# Altium schematic sheet Yusynth VCA - Schematic.SchDoc
size Letter
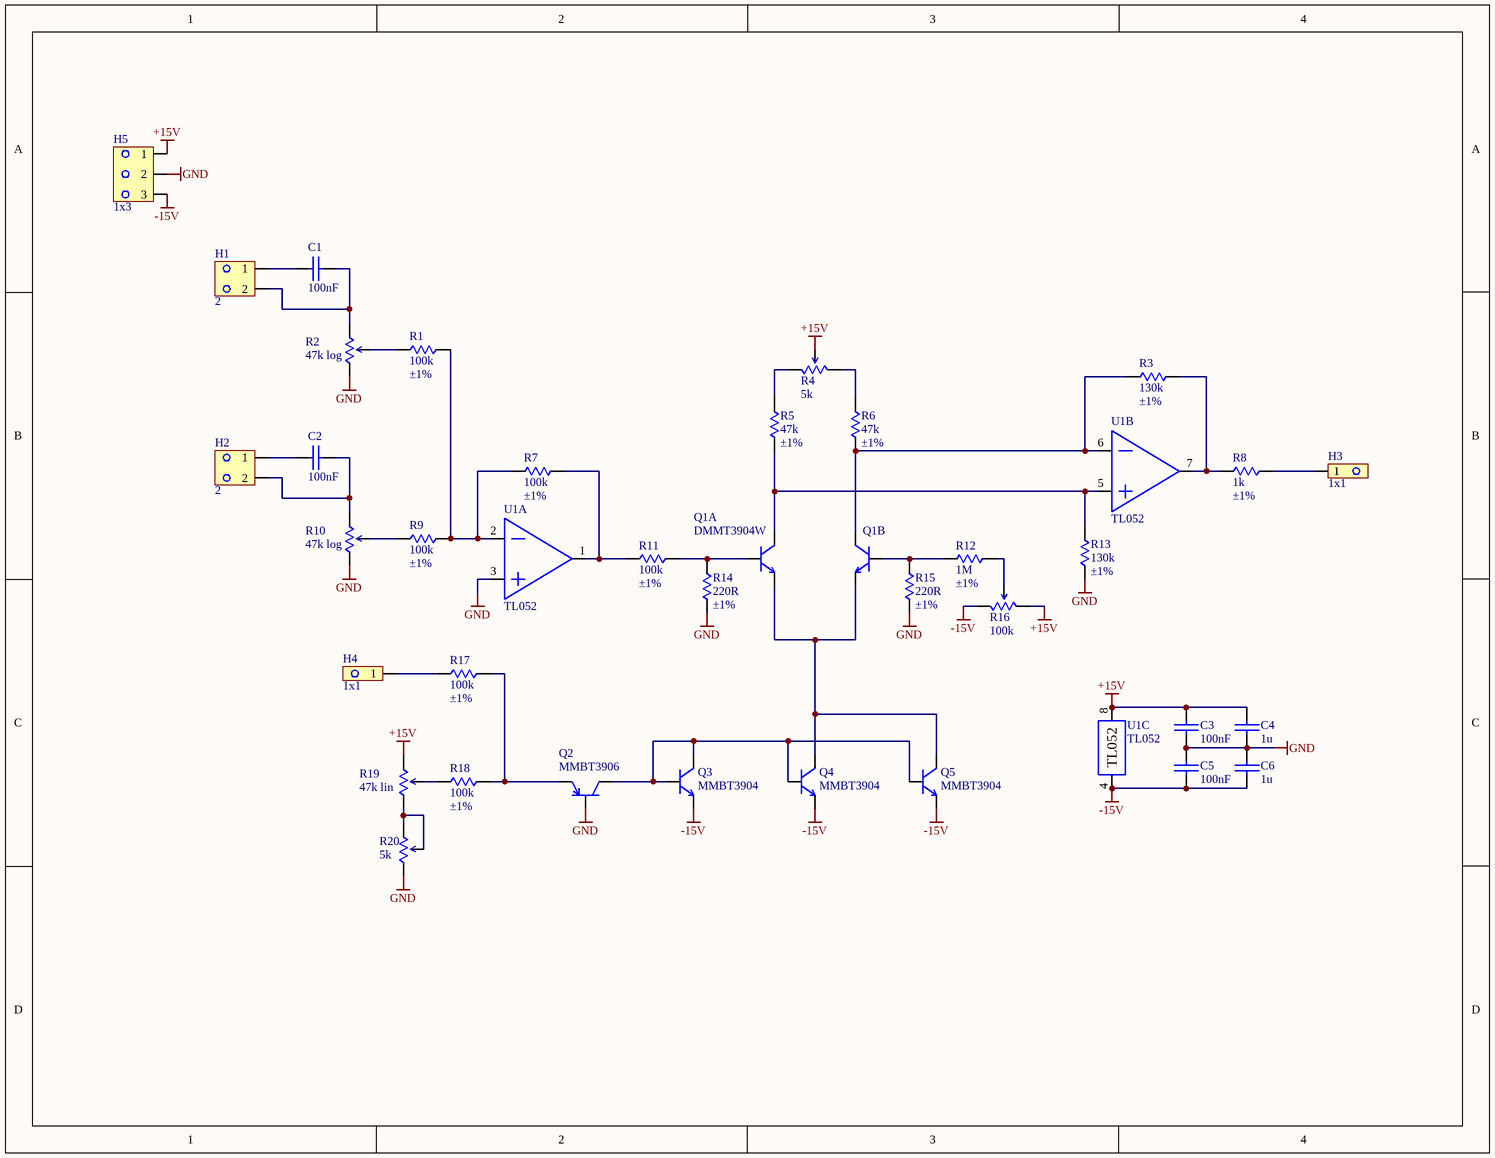
[diagram p0: Yusynth VCA - Schematic.SchDoc]

## Parts
C1  100nF  [JEDEC - 0603 - cap]
C2  100nF  [JEDEC - 0603 - cap]
C3  100nF  [JEDEC - 0603 - cap]
C4  1u  [JEDEC - 0603 - cap]
C5  100nF  [JEDEC - 0603 - cap]
C6  1u  [JEDEC - 0603 - cap]
H1  2  [H - 100MIL - 1x2]
H2  2  [H - 100MIL - 1x2]
H3  1x1  [H - 100MIL - 1x1]
H4  1x1  [H - 100MIL - 1x1]
H5  1x3  [H - 100MIL - 1x3]
Q1  DMMT3904W  [Diodes Inc - SOT363]  (parts A,B of 2)
Q2  MMBT3906  [SOT 23]
Q3  MMBT3904  [SOT 23]
Q4  MMBT3904  [SOT 23]
Q5  MMBT3904  [SOT 23]
R1  100k  Tolerance: ±1%  [JEDEC - 0603]
R2  47k log  [H - 100MIL - 1x3]
R3  130k  Tolerance: ±1%  [JEDEC - 0603]
R4  5k  [POT - CTS - 262 Series]
R5  47k  Tolerance: ±1%  [JEDEC - 0603]
R6  47k  Tolerance: ±1%  [JEDEC - 0603]
R7  100k  Tolerance: ±1%  [JEDEC - 0603]
R8  1k  Tolerance: ±1%  [JEDEC - 0603]
R9  100k  Tolerance: ±1%  [JEDEC - 0603]
R10  47k log  [H - 100MIL - 1x3]
R11  100k  Tolerance: ±1%  [JEDEC - 0603]
R12  1M  Tolerance: ±1%  [JEDEC - 0603]
R13  130k  Tolerance: ±1%  [JEDEC - 0603]
R14  220R  Tolerance: ±1%  [JEDEC - 0603]
R15  220R  Tolerance: ±1%  [JEDEC - 0603]
R16  100k  [POT - CTS - 262 Series]
R17  100k  Tolerance: ±1%  [JEDEC - 0603]
R18  100k  Tolerance: ±1%  [JEDEC - 0603]
R19  47k lin  [H - 100MIL - 1x3]
R20  5k  [POT - CTS - 262 Series]
U1  TL052  [TI - D (R-PDSO-G8)]  (parts A,B,C of 3)

## Nets
+15V: C3.2 C4.1 H5.1 R4.3 R16.2 R19.3 U1.8
-15V: C5.1 C6.2 H5.3 Q3.2 Q4.2 Q5.2 R16.1 U1.4
GND: C3.1 C4.2 C5.2 C6.1 H5.2 Q2.1 R2.1 R10.1 R13.1 R14.1 R15.1 R20.1 U1.3
NetC1_1: C1.1 H1.1
NetC1_2: C1.2 H1.2 R2.3
NetC2_1: C2.1 H2.1
NetC2_2: C2.2 H2.2 R10.3
NetH3_1: H3.1 R8.2
NetH4_1: H4.1 R17.1
NetQ1_1: Q1.1 R11.2 R14.2
NetQ1_2: Q1.2 R12.1 R15.2
NetQ1_3: Q1.3 R3.2 R6.1 U1.6
NetQ1_4: Q1.4 Q1.5 Q4.3 Q5.3
NetQ1_6: Q1.6 R5.1 R13.2 U1.5
NetQ2_2: Q2.2 R17.2 R18.2
NetQ2_3: Q2.3 Q3.1 Q3.3 Q4.1 Q5.1
NetR1_1: R1.1 R2.2
NetR1_2: R1.2 R7.1 R9.2 U1.2
NetR3_1: R3.1 R8.1 U1.7
NetR4_1: R4.1 R5.2
NetR4_2: R4.2 R6.2
NetR7_2: R7.2 R11.1 U1.1
NetR9_1: R9.1 R10.2
NetR12_2: R12.2 R16.3
NetR18_1: R18.1 R19.2
NetR19_1: R19.1 R20.2 R20.3

## Library data of the parts
C1-C3 C5 = c - 100nF: CAP CER 0.1UF 50V X7R 0603; MFG: Yageo; MFG PN: CC0603KRX7R9BB104; tolerance: ±10%; op temp: -55°C ~ 125°C; Digi-Key PN: 311-1344-1-ND; package: 0603; voltage: 50V; capacitance: 100nF; Temp Coeff: X7R; height: 0.90mm; price/1: 0.047
C4 C6 = c - 1uF 50V 0603: CAP CER 1UF 50V X5R 0603; MFG: Yageo; MFG PN: CC0603KRX5R9BB105; tolerance: ±10%; capacitance: 1µF; op temp: -55°C ~ 85°C; Digi-Key PN: 311-1787-1-ND; package: 0603; voltage: 50V; Temp Coeff: X5R; height: 0.9mm; price/1 @10: $0.182; Series: CC
H1 H2 = Header - 1x2
H3 H4 = Header - 1x1
H5 = Header - 1x3
Q1 = tran - matched npn - DMMT3904W: TRANS 2NPN 40V 0.2A SOT363; MFG: Diodes Inc.; MFG PN: DMMT3904W-7-F; op temp: -65°C ~ 150°C (TJ); Transistor Type: 2 NPN (Dual) Matched Pair; Current - Collector (Ic) (Max): 200mA; Vce Saturation (Max) @ Ib, Ic: 300mV @ 5mA, 50mA; DC Current Gain (hFE) (Min) @ Ic, Vce: 100 @ 10mA, 1V; Power - Max: 200mW; Frequency - Transition: 300MHz; ComponentLink1Description: datasheet; ComponentLink1URL: C:\Users\Adam Gulyas\Desktop\Electrical Design\datasheets\tran - matched npn\Diodes Inc - DMMT3904W.pdf; Digi-Key PN: DMMT3904W-FDICT-ND; height: 1.1mm; package: 6-TSSOP, SC-88, SOT-363; price/1 @ 10: $0.444; series: -; Voltage - Collector Emitter Breakdown (Max): 40V; Current - Collector Cutoff (Max): -
Q2 = tran - PNP - MMBT3906: TRANS PNP 40V 0.2A SOT23; MFG_PN: MMBT3906-TP; MFG: Micro Commercial Co; Digi-Key_PN: MMBT3906-TPTR-ND; package: SOT-23-3; ComponentLink1Description: datasheet; ComponentLink1URL: C:\Users\Adam\Desktop\Reference\datasheets\transistor - bjt - pnp\MCC - MMBT3906.pdf; height max: 1.22mm
Q3-Q5 = tran - NPN - MMBT3904: TRANS NPN 40V 0.2A SOT23; MFG: Micro Commercial; MFG_PN: MMBT3904-TP; current: 200mA; Digi-Key_PN: MMBT3904TPMSCT-ND; package: SOT 23; ComponentLink1Description: datasheet; ComponentLink1URL: C:\Users\Adam\Desktop\Reference\datasheets\transistor - bjt - npn\MCC - MMBT3904.pdf; height max: 1.22mm
R1 R7 R9 R11 R17 R18 = R - 100k 1% 0603: RES SMD 100K OHM 1% 1/10W 0603; MFG: Yageo; MFG PN: RC0603FR-07100KL; Resistance: 100 kOhms; Power (Watts): 0.1W; temp coeff: ±100ppm/°C; op temp: -55°C ~ 155°C; Digi-Key PN: 311-100KHRCT-ND; package: 0603; price/1 @10: $0.022; Series: RC; Composition: Thick Film; Features: Moisture Resistant; height: 0.55mm
R2 R10 R19 = g - pot 3: purpose: *
R3 R13 = R - 130k 1% 0603: RES SMD 130K OHM 1% 1/10W 0603; MFG: Yageo; MFG PN: RC0603FR-07130KL; Resistance: 130 kOhms; Power (Watts): 0.1W; temp coeff: ±100ppm/°C; op temp: -55°C ~ 155°C; Digi-Key PN: 311-130KHRCT-ND; package: 0603; price/1 @10: $0.022; Series: RC; Composition: Thick Film; Features: Moisture Resistant; height: 0.55mm
R4 R20 = pot - 262 - 5k: TRIMMER 5K OHM 0.15W TH; MFG: CTS Electrocomponents; MFG PN: 262UR502B; Tolerance: 20%; # of Turns: 1; Digi-Key PN: 262UR502B-ND; purpose: *; Resistance: 5k; Power: 0.15W; Temp Coeff: -; Composition: Carbon; size: 9.40 x 10.00 x 5.40mm; Taper: linear
R5 R6 = R - 47k 1% 0603: RES SMD 47K OHM 1% 1/10W 0603; MFG: Yageo; MFG PN: RC0603FR-0747KL; Resistance: 47 kOhms; Power (Watts): 0.1W; temp coeff: ±100ppm/°C; op temp: -55°C ~ 155°C; Digi-Key PN: 311-47.0KHRCT-ND; package: 0603; price/1 @10: $0.022; Series: RC; Composition: Thick Film; Features: Moisture Resistant; height: 0.55mm
R8 = R - 1k 1% 0603: RES SMD 1K OHM 1% 1/10W 0603; MFG: Yageo; MFG PN: RC0603FR-071KL; Resistance: 1 kOhms; Power (Watts): 0.1W; temp coeff: ±100ppm/°C; op temp: -55°C ~ 155°C; Digi-Key PN: 311-1.00KHRCT-ND; package: 0603; price/1 @10: $0.022; Series: RC; Composition: Thick Film; Features: Moisture Resistant; height: 0.55mm
R12 = R - 1M 1% 0603: RES SMD 1M OHM 1% 1/10W 0603; MFG: Yageo; MFG PN: RC0603FR-071ML; Resistance: 1 MOhms; Power (Watts): 0.1W; temp coeff: ±100ppm/°C; op temp: -55°C ~ 155°C; Digi-Key PN: 311-1.00MHRCT-ND; package: 0603; price/1 @10: $0.022; Series: RC; Composition: Thick Film; Features: Moisture Resistant; height: 0.55mm
R14 R15 = R - 220R 1% 0603: RES SMD 220 OHM 1% 1/10W 0603; MFG: Yageo; MFG PN: RC0603FR-07220RL; Resistance: 220 Ohms; Power (Watts): 0.1W; temp coeff: ±100ppm/°C; op temp: -55°C ~ 155°C; Digi-Key PN: 311-220HRCT-ND; package: 0603; price/1 @10: $0.022; Series: RC; Composition: Thick Film; Features: Moisture Resistant; height: 0.55mm
R16 = pot - 262 - 100k: TRIMMER 100K OHM 0.15W TH; MFG: CTS Electrocomponents; MFG PN: 262UR104B; Tolerance: 20%; # of Turns: 1; Digi-Key PN: 262UR104B-ND; purpose: *; Resistance: 100k; Power: 0.15W; Temp Coeff: -; Composition: Carbon; size: 9.40 x 10.00 x 5.40mm; Taper: linear
U1 = op amp - TL052: IC OPAMP JFET 3MHZ 8SOIC; MFG: TI; MFG PN: TL052CDR; op temp: 0°C ~ 70°C; Amplifier Type: J-FET; Number of Circuits: 2; Slew Rate: 20.7 V/µs; Current - Input Bias: 30pA; Voltage - Input Offset: 650µV; Current - Supply: 4.8mA; Current - Output / Channel: 80mA; Voltage - Supply, Single/Dual (±): 10 V ~ 30 V, ±5 V ~ 15 V; Digi-Key PN: 296-24365-1-ND; package: 8-SOIC (3.9mm Width); price/1 @ 10: $0.778; Output Type: -; Gain Bandwidth Product: 3MHz; ComponentLink1Description: datasheet; ComponentLink1URL: C:\Users\Adam Gulyas\Desktop\Electrical Design\datasheets\op amp\TI - TL05x.pdf